# EAGLE design motherBoard (EAGLE 9.3.1)

## Sheet 1 of 2
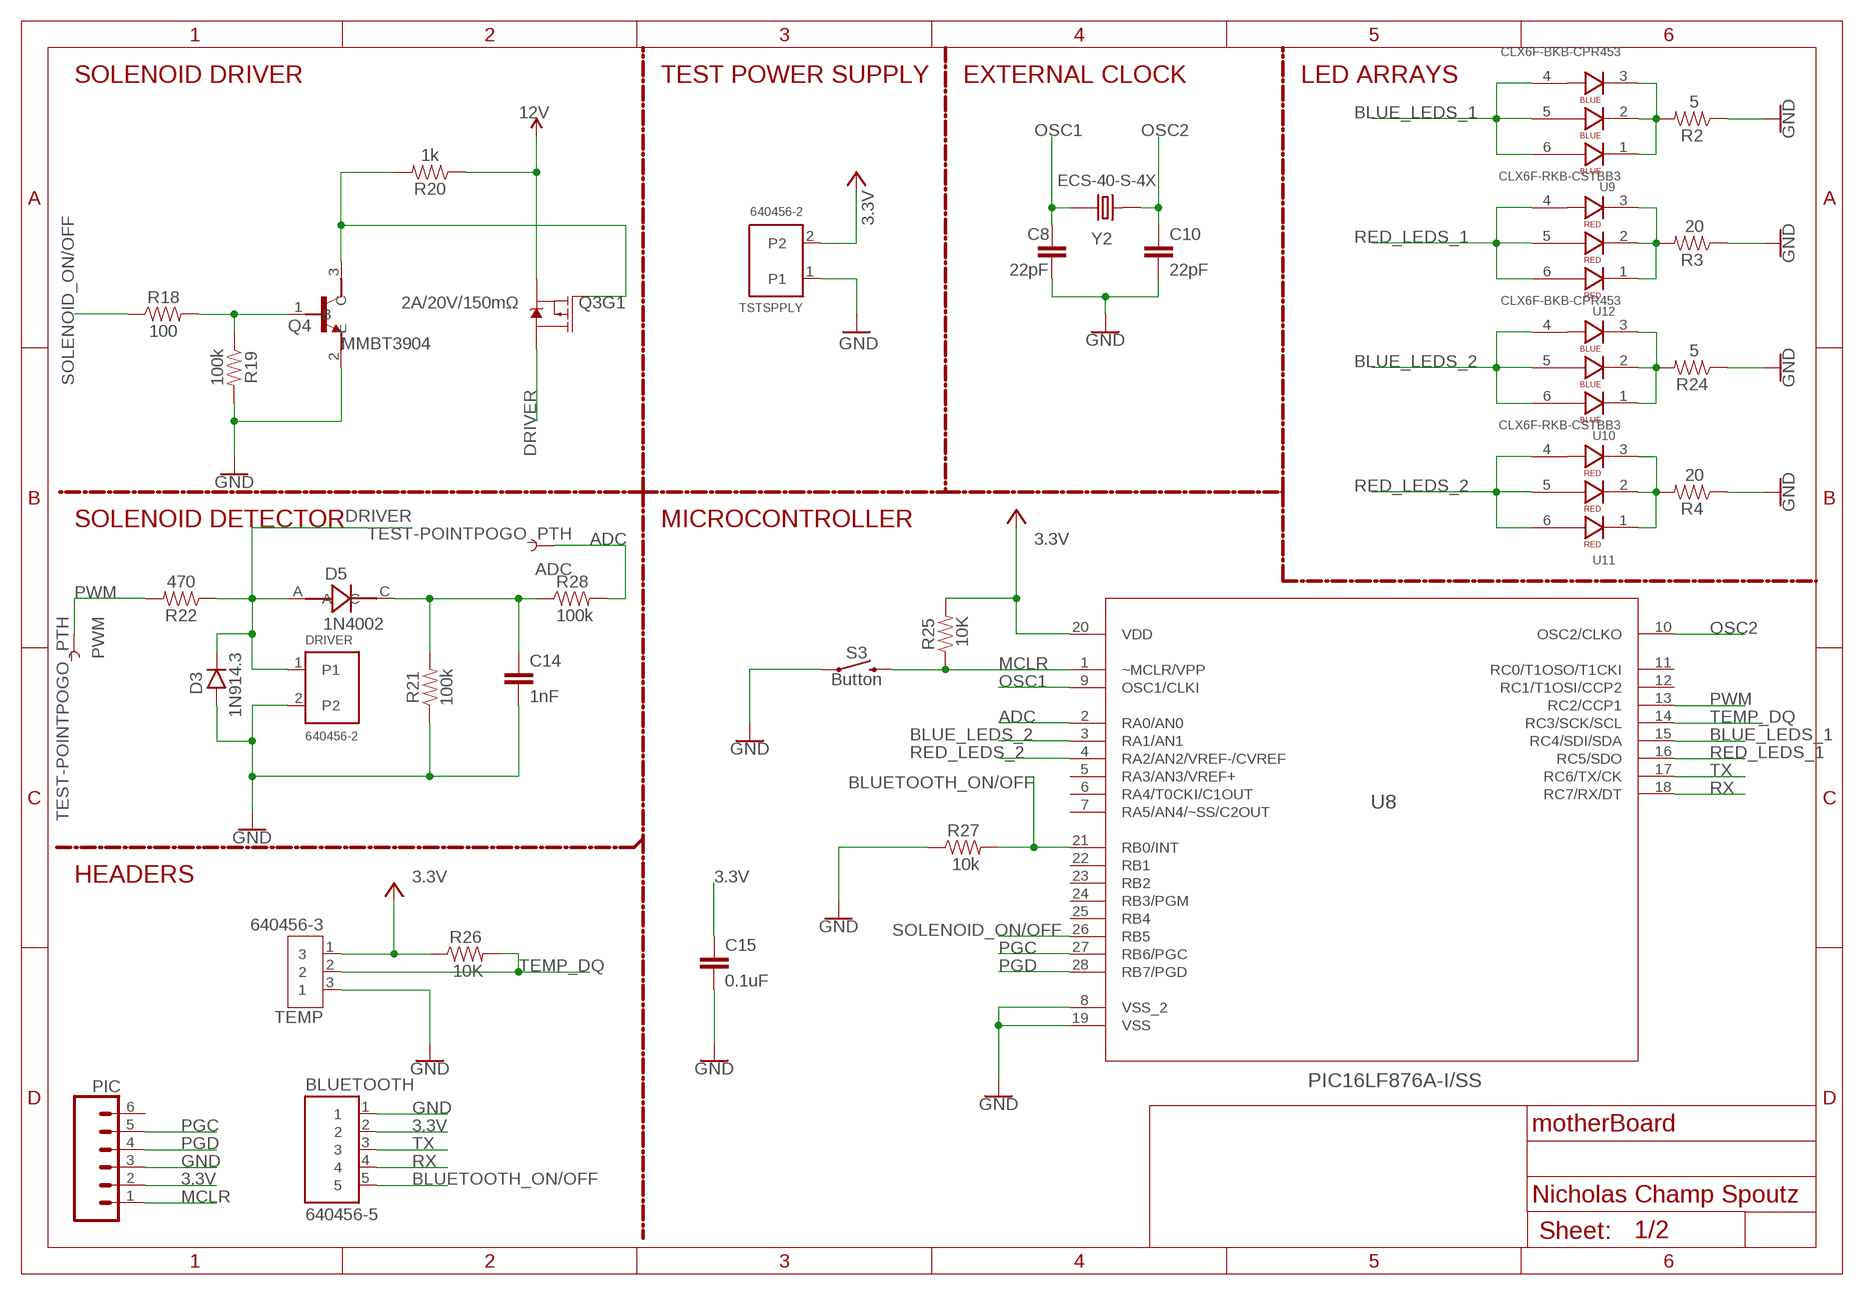
[diagram p0: schematic, sheet 1]

### Parts
ADC  TEST-POINTPOGO_PTH  [1X01_NO_SILK]
BLUETOOTH  640456-5  [TE_640456-5]
C8  22pF  22PF-0603-50V-5%  [0603]
C10  22pF  22PF-0603-50V-5%  [0603]
C14  1nF  1.0NF/1000PF-0603-50V-10%  [0603]
C15  0.1uF  0.1UF-0603-25V-5%  [0603]
D3  1N914.3  [DO35-3]
D5  1N4002  [DIOAD520W79L463D238]
DRIVER  640456-2  [TE_640456-2]
PIC  CONN_06SILK_FEMALE_PTH  [1X06]
PWM  TEST-POINTPOGO_PTH  [1X01_NO_SILK]
Q3  2A/20V/150mΩ  MOSFET_PCH_DUAL-DMP2240UDM  [SOT26]
Q4  MMBT3904  [SOT95P240X120-3N]
R2  5  RESISTOR0603  [0603]
R3  20  RESISTOR0603  [0603]
R4  20  RESISTOR0603  [0603]
R18  100  100OHM-0603-1/4W-5%  [0603]
R19  100k  100KOHM-0603-1/10W-1%  [0603]
R20  1k  1KOHM-0603-1/10W-1%  [0603]
R21  100k  100KOHM-0603-1/10W-1%  [0603]
R22  470  470OHM-0603-1/10W-1%  [0603]
R24  5  RESISTOR0603  [0603]
R25  10K  RESISTOR0603  [0603]
R26  10K  RESISTOR0603  [0603]
R27  10k  RESISTOR0603  [0603]
R28  100k  RESISTOR0603  [0603]
S3  Button  MOMENTARY-SWITCH-SPST-SMD-5.2MM  [TACTILE_SWITCH_SMD_5.2MM]
TEMP  640456-3  [CONN_640456-3]
TSTSPPLY  640456-2  [TE_640456-2]
U8  PIC16LF876A-I/SS  [SOP254P785X200-28N]
U9  CLX6F-BKB-CPR453  [SOJ100P350X290-6N]
U10  CLX6F-BKB-CPR453  [SOJ100P350X290-6N]
U11  CLX6F-RKB-CSTBB3  [SOJ100P350X290-6N]
U12  CLX6F-RKB-CSTBB3  [SOJ100P350X290-6N]
Y2  ECS-40-S-4X  [XTAL_ECS-40-S-4X]

### Nets
3.3V: BLUETOOTH.2 C15.1 PIC.2 R25.2 R26.1 TEMP.1 TSTSPPLY.2 U8.20(VDD) ; also sheet 2
12V: Q3.S1(S) R20.1 ; also sheet 2
ADC: ADC.1 R28.2 U8.2(RA0/AN0)
BLUE_LEDS_1: U8.15(RC4/SDI/SDA) U9.4 U9.5 U9.6
BLUE_LEDS_2: U8.3(RA1/AN1) U10.4 U10.5 U10.6
BLUETOOTH_ON/OFF: BLUETOOTH.5 R27.2 U8.21(RB0/INT)
DRIVER: D3.C D5.A DRIVER.1 Q3.D1(D) R22.1
GND: BLUETOOTH.1 C8.2 C10.2 C14.2 C15.2 D3.A DRIVER.2 PIC.3 Q4.2(E) R2.1 R3.1 R4.1 R19.2 R21.1 R24.1 R27.1 S3.1 TEMP.3 TSTSPPLY.1 U8.8(VSS_2) U8.19(VSS) ; also sheet 2
MCLR: PIC.1 R25.1 S3.3 U8.1(~MCLR/VPP)
N$3: R2.2 U9.1 U9.2 U9.3
N$4: C14.1 D5.C R21.2 R28.1
N$5: R3.2 U12.1 U12.2 U12.3
N$21: R24.2 U10.1 U10.2 U10.3
N$22: Q4.1(B) R18.2 R19.1
N$23: Q3.G1(G) Q4.3(C) R20.2
N$25: R4.2 U11.1 U11.2 U11.3
OSC1: C8.1 U8.9(OSC1/CLKI) Y2.1
OSC2: C10.1 U8.10(OSC2/CLKO) Y2.2
PGC: PIC.5 U8.27(RB6/PGC)
PGD: PIC.4 U8.28(RB7/PGD)
PWM: PWM.1 R22.2 U8.13(RC2/CCP1)
RED_LEDS_1: U8.16(RC5/SDO) U12.4 U12.5 U12.6
RED_LEDS_2: U8.4(RA2/AN2/VREF-/CVREF) U11.4 U11.5 U11.6
RX: BLUETOOTH.4 U8.18(RC7/RX/DT)
SOLENOID_ON/OFF: R18.1 U8.26(RB5)
TEMP_DQ: R26.2 TEMP.2 U8.14(RC3/SCK/SCL)
TX: BLUETOOTH.3 U8.17(RC6/TX/CK)
Unconnected: PIC.6 Q3.D2(D) Q3.G2(G) Q3.S2(S) U8.5(RA3/AN3/VREF+) U8.6(RA4/T0CKI/C1OUT) U8.7(RA5/AN4/~SS/C2OUT) U8.11(RC0/T1OSO/T1CKI) U8.12(RC1/T1OSI/CCP2) U8.22(RB1) U8.23(RB2) U8.24(RB3/PGM) U8.25(RB4)

### Notes on the sheet
- SOLENOID DRIVER | TEST POWER SUPPLY | EXTERNAL CLOCK | LED ARRAYS
- SOLENOID DETECTOR | MICROCONTROLLER
- HEADERS
- Nicholas Champ Spoutz

## Sheet 2 of 2
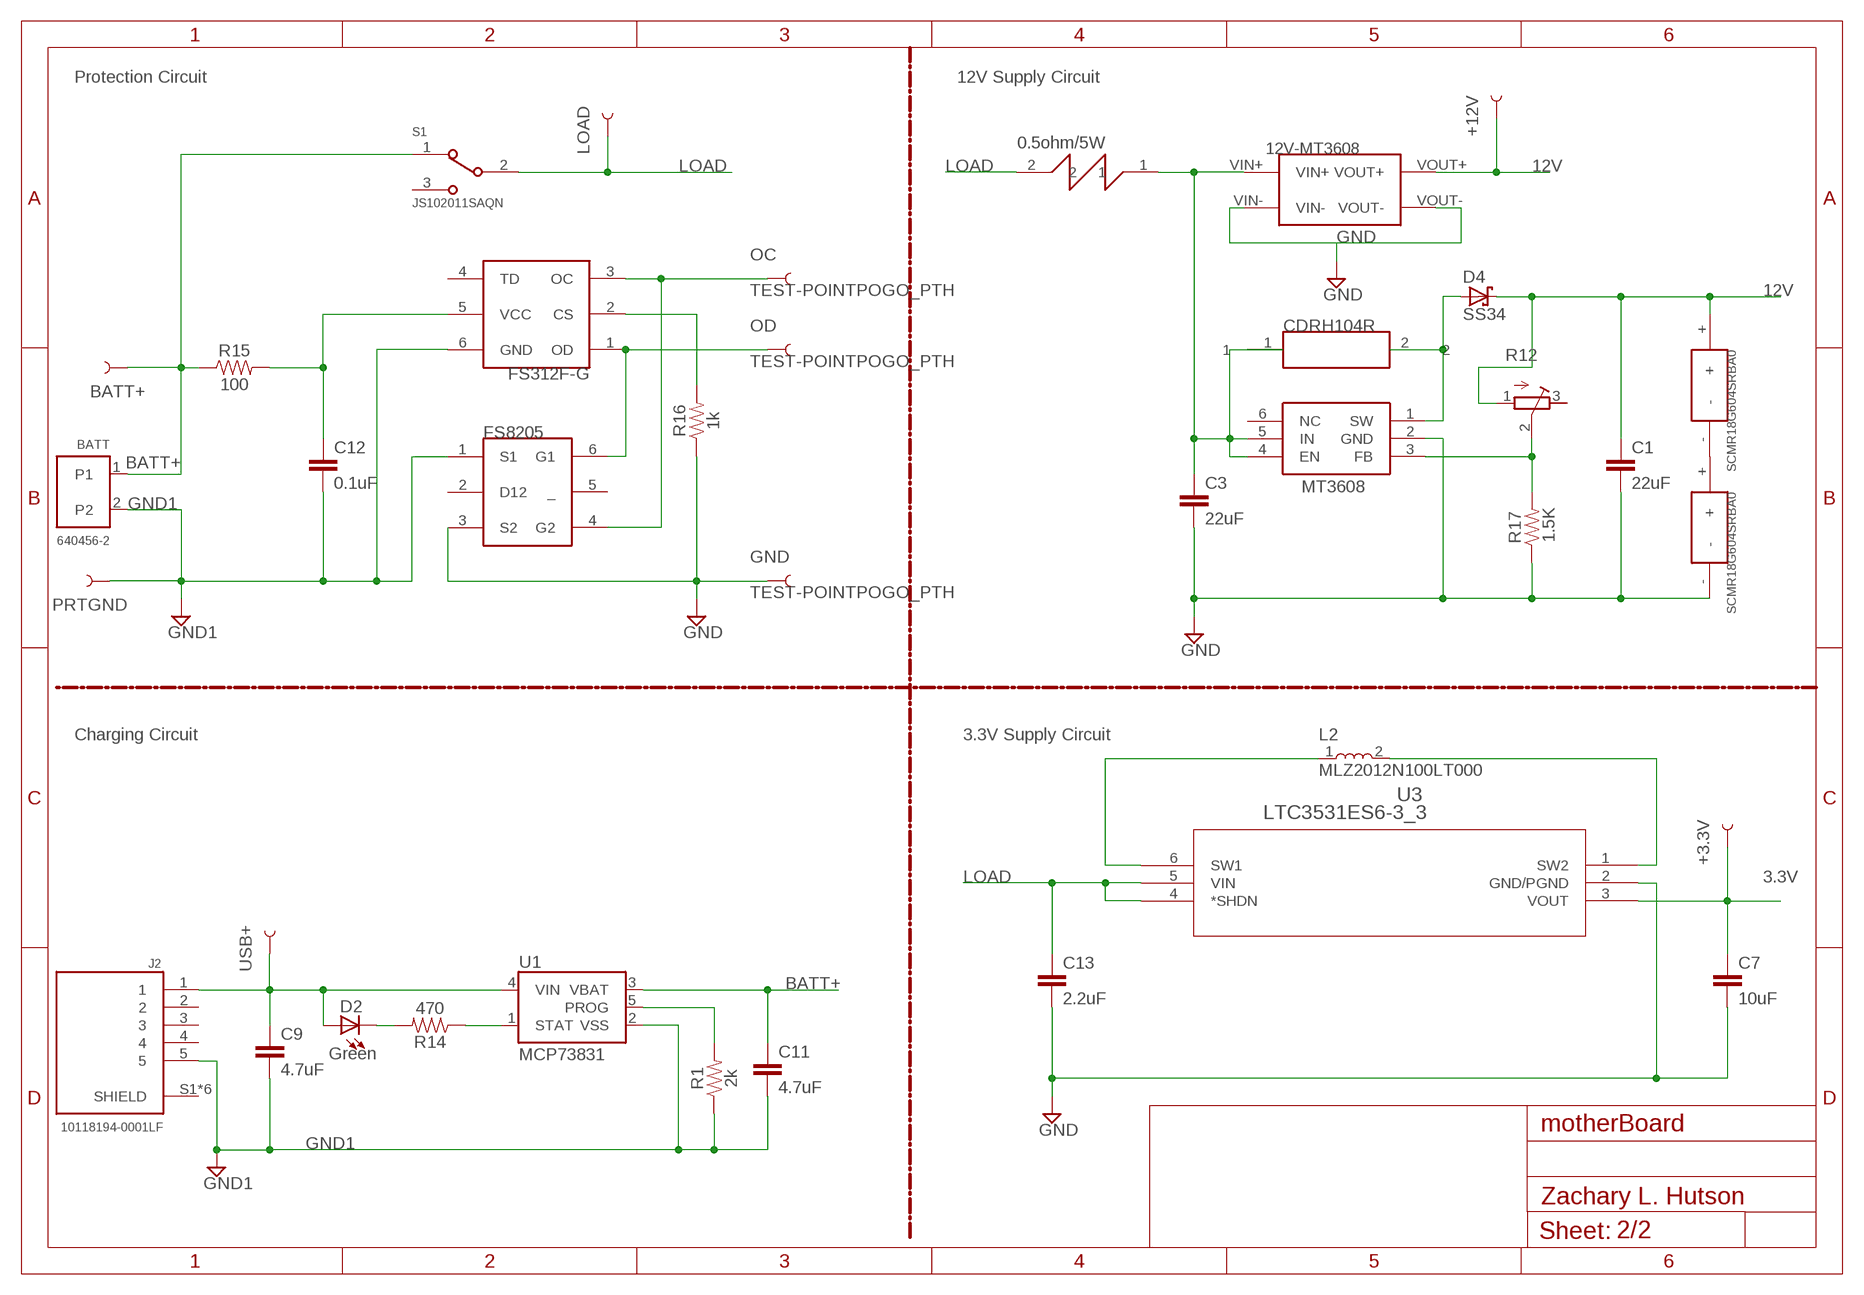
[diagram p1: schematic, sheet 2]

### Parts
+3.3V  TEST-POINTPOGO_PTH  [1X01_NO_SILK]
+12V  TEST-POINTPOGO_PTH  [1X01_NO_SILK]
BATT  640456-2  [TE_640456-2]
BATT+  TEST-POINTPOGO_PTH  [1X01_NO_SILK]
C1  22uF  22UF-0805-6.3V-20%  [0805]
C3  22uF  10UF-0603-6.3V-20%  [0603]
C7  10uF  10UF-0603-6.3V-20%  [0603]
C9  4.7uF  10UF-0603-6.3V-20%  [0603]
C11  4.7uF  0.1UF-0603-25V-(+80/-20%)  [0603]
C12  0.1uF  0.1UF-0603-25V-(+80/-20%)  [0603]
C13  2.2uF  2.2UF-0603-10V-20%  [0603]
C16  SCMR18G604SRBA0  [SUPERCAP]
C17  SCMR18G604SRBA0  [SUPERCAP]
D2  Green  LED0603  [LED-0603]
D4  SS34  [SMB]
GND  TEST-POINTPOGO_PTH  [1X01_NO_SILK]
J2  10118194-0001LF  [AMPHENOL_10118194-0001LF]
L1  CDRH104R  [220-INDUCTOR]
L2  MLZ2012N100LT000  [INDC2012X125]
LOAD  TEST-POINTPOGO_PTH  [1X01_NO_SILK]
OC  TEST-POINTPOGO_PTH  [1X01_NO_SILK]
OD  TEST-POINTPOGO_PTH  [1X01_NO_SILK]
PRTGND  TEST-POINTPOGO_PTH  [1X01_NO_SILK]
R1  2k  RESISTOR0603  [0603]
R12  R-TRIMM3296P  [RTRIM3296P]
R14  470  RESISTOR0603  [0603]
R15  100  RESISTOR0603  [0603]
R16  1k  RESISTOR0603  [0603]
R17  1.5K  RESISTOR0603  [0603]
R30  WNER50FET  [RESISTOR]
S1  JS102011SAQN  [SW_JS102011SAQN]
U1  MCP73831  [SOT23-5]
U2  MT3608  [SOT95P280X145-6N]
U3  LTC3531ES6-3_3  [TSOT-23_S6]
U$1  12V-BOARD  [PERF_BOARD]
U$3  FS312F-G  [SOT-23-6]
U$4  FS8205  [SOT-23-6]
USB+  TEST-POINTPOGO_PTH  [1X01_NO_SILK]

### Nets
3.3V: +3.3V.1 C7.1 U3.3(VOUT) ; also sheet 1
12V: +12V.1 C1.1 C16.+ D4.C R12.1(E) U$1.VOUT+ ; also sheet 1
BATT+: BATT+.1 BATT.1 C11.1 R15.1 S1.1 U1.3(VBAT)
GND: C1.2 C3.2 C7.2 C13.2 C17.- GND.1 R16.1 R17.1 U2.2(GND) U3.2(GND/PGND) U$1.VIN- U$1.VOUT- U$4.3(S2) ; also sheet 1
GND1: BATT.2 C9.2 C11.2 C12.2 J2.5 PRTGND.1 R1.1 U1.2(VSS) U$3.6(GND) U$4.1(S1)
LOAD: C13.1 LOAD.1 R30.2 S1.2 U3.4(*SHDN) U3.5(VIN)
N$1: D2.C R14.2
N$2: C3.1 L1.1 R30.1 U2.4(EN) U2.5(IN) U$1.VIN+
N$7: R14.1 U1.1(STAT)
N$9: R1.2 U1.5(PROG)
N$10: R16.2 U$3.2(CS)
N$11: C9.1 D2.A J2.1 U1.4(VIN) USB+.1
N$12: D4.A L1.2 U2.1(SW)
N$13: R12.2(S) R17.2 U2.3(FB)
N$14: L2.1 U3.6(SW1)
N$15: L2.2 U3.1(SW2)
N$17: OD.1 U$3.1(OD) U$4.6(G1)
N$18: OC.1 U$3.3(OC) U$4.4(G2)
N$19: C16.- C17.+
N$20: C12.1 R15.2 U$3.5(VCC)
Unconnected: J2.2 J2.3 J2.4 J2.S1(SHIELD) J2.S2(SHIELD) J2.S3(SHIELD) J2.S4(SHIELD) J2.S5(SHIELD) J2.S6(SHIELD) R12.3(A) S1.3 U2.6(NC) U$3.4(TD) U$4.2(D12) U$4.5(_)

### Notes on the sheet
- Protection Circuit | 12V Supply Circuit
- Charging Circuit | 3.3V Supply Circuit
- Zachary L. Hutson

## Library data of the parts
+3.3V +12V ADC BATT+ GND LOAD OC OD PRTGND PWM USB+ = SparkFun-Connectors:TEST-POINT: SparkFun Test Points Bare copper test points for troubleshooting or In-Circuit-Testing. These are used by our Production team for verifying production board runs using pogo-pins on test beds. SparkFun Products: SparkFun LSM9DS1 Breakout <https://www.sparkfun.com/products/13284> SparkFun PSOC <https://www.sparkfun.com/products/13714> SparkFun Load Cell Amplifier <https://www.sparkfun.com/products/13879>
BATT DRIVER TSTSPPLY = 640456-2:640456-2: CONN HEADER VERT 2POS .100 TIN; COMMENT: 640456-2; DESCRIPTION: 02P MTA100 HDR ASSY F/L SQ STR; DIGI-KEY_PART_NUMBER: A1921-ND; DIGI-KEY_PURCHASE_URL: https://www.digikey.com/product-detail/en/te-connectivity-amp-connectors/640456-2/A1921-ND/109003?utm_source=snapeda&utm_medium=aggregator&utm_campaign=symbol; EU_ROHS_COMPLIANCE: Compliant; MF: TE Connectivity; MP: 640456-2; PACKAGE: None; TE_PURCHASE_URL: https://www.te.com/usa-en/product-640456-2.html?te_bu=Cor&te_type=disp&te_campaign=seda_glo_cor-seda-global-disp-prtnr-fy19-seda-model-bom-cta_sma-317_1&elqCampaignId=32493
BLUETOOTH = 640456-5:640456-5: CONN HEADER VERT 5POS .100 TIN; CENTERLINE_PITCH: 2.54 mm[.1 in]; COMMENT: 640456-5; DESCRIPTION: 05P MTA100 HDR ASSY F/L SQ STR; DIGI-KEY_PART_NUMBER: A19471-ND; DIGI-KEY_PURCHASE_URL: https://www.digikey.com/product-detail/en/te-connectivity-amp-connectors/640456-5/A19471-ND/259011?utm_source=snapeda&utm_medium=aggregator&utm_campaign=symbol; EU_ROHS_COMPLIANCE: Compliant; MF: TE Connectivity; MP: 640456-5; NUMBER_OF_POSITIONS: 5; PACKAGE: None; PRODUCT_TYPE: Connector; TE_PURCHASE_URL: https://www.te.com/usa-en/product-640456-5.html?te_bu=Cor&te_type=disp&te_campaign=seda_glo_cor-seda-global-disp-prtnr-fy19-seda-model-bom-cta_sma-317_1&elqCampaignId=32493
C1 = SparkFun-Capacitors:22UF: 22µF ceramic capacitors A capacitor is a passive two-terminal electrical component used to store electrical energy temporarily in an electric field.; PROD_ID: CAP-08402
C3 C9 = SparkFun-Capacitors:10UF: 10.0µF ceramic capacitors A capacitor is a passive two-terminal electrical component used to store electrical energy temporarily in an electric field.; PROD_ID: CAP-11015; VALUE: 10uF
C7 = SparkFun-Capacitors:10UF: 10.0µF ceramic capacitors A capacitor is a passive two-terminal electrical component used to store electrical energy temporarily in an electric field.; PROD_ID: CAP-11015
C8 C10 = SparkFun-Capacitors:22PF: 22pF ceramic capacitors A capacitor is a passive two-terminal electrical component used to store electrical energy temporarily in an electric field.; PROD_ID: CAP-07876
C11 = SparkFun-Capacitors:0.1UF: 0.1µF ceramic capacitors A capacitor is a passive two-terminal electrical component used to store electrical energy temporarily in an electric field.; PROD_ID: CAP-00810; VALUE: 0.1uF
C12 = SparkFun-Capacitors:0.1UF: 0.1µF ceramic capacitors A capacitor is a passive two-terminal electrical component used to store electrical energy temporarily in an electric field.; PROD_ID: CAP-00810
C13 = SparkFun-Capacitors:2.2UF: 2.2µF ceramic capacitors A capacitor is a passive two-terminal electrical component used to store electrical energy temporarily in an electric field.; PROD_ID: CAP-07888
C14 = SparkFun-Capacitors:1.0NF/1000PF: 1nF/1,000pF ceramic capacitors A capacitor is a passive two-terminal electrical component used to store electrical energy temporarily in an electric field.; PROD_ID: CAP-07886
C15 = SparkFun-Capacitors:0.1UF: 0.1µF ceramic capacitors A capacitor is a passive two-terminal electrical component used to store electrical energy temporarily in an electric field.; PROD_ID: CAP-08604
C16 C17 = SCMRCapacitor:SCMR18G604SRBA0: SCMR18G604SRBA0: 0.6F/7.5V/1.77A
D2 = SparkFun:LED: LEDs Standard schematic elements and footprints for 5mm, 3mm, 1206, and 0603 sized LEDs. 5mm - Spark Fun Electronics SKU : COM-00529 (and others)
D3 = 1N914:1N914: Fast Switching Diode DO-35 glass case a.k.a. 1N4148; AVAILABILITY: Unavailable; DESCRIPTION: 1N914 Series 500 mW 100 V Max Reverse Voltage Small Signal Diode - DO-35; MF: Microsemi Corporation; MP: 1N914; PACKAGE: DO-35 ON Semiconductor; PRICE: None
D4 = SS34:SS34: 3A 40V Schottky diode; AVAILABILITY: Unavailable; DESCRIPTION: SS Series 500 mV 3 A 40 V Max Reverse Voltage Schottky Rectifier - DO-214AB; MF: ON Semiconductor; MP: SS34; PACKAGE: DO-214 ON Semiconductor; PRICE: None
D5 = 1N4002:1N4002: 1N400 Series 1.1 V 1 A 100 V Max Reverse Voltage Standard Rectifier - DO-41; AVAILABILITY: Unavailable; DESCRIPTION: Diode Gen Purp 100v 1a Do41; MF: ON Semiconductor; MP: 1N4002; PACKAGE: DO-204 MCC; PRICE: None
J2 = 10118194-0001LF:10118194-0001LF: Micro Usb, 2.0 Type b, Rcpt, Smt; AVAILABILITY: Unavailable; DESCRIPTION: Micro Usb, 2.0 Type b, Rcpt, Smt; MF: Amphenol ICC; MP: 10118194-0001LF; PACKAGE: None; PRICE: None
L1 = CDRH104R:CDRH104R: CDRH104C: Ferrite drum core construction. • Magnetically shielded. • L×W×H:10.5×10.3×4.0mm Max. • Product weight: 1.5g(Ref.) • Moisture Sensitivity Level: 1 • RoHS compliance. • Halogen Free available.
L2 = MLZ2012N100LT000:MLZ2012N100LT000: Surface Mount High Frequency Inductor, MLZ Series, 10 H, 20%, 0805 [2012 Metric], 0.3 ohm; DESCRIPTION: Surface Mount High Frequency Inductor, MLZ Series, 10 H, 20%, 0805 [2012 Metric], 0.3 ohm; DIGI-KEY_PART_NUMBER: 445-6762-1-ND; DIGI-KEY_PURCHASE_URL: https://www.digikey.com/product-detail/en/tdk-corporation/MLZ2012N100LT000/445-6762-1-ND/2523583?utm_source=snapeda&utm_medium=aggregator&utm_campaign=symbol; MF: TDK; MP: MLZ2012N100LT000; PACKAGE: 0805 TDK
PIC = SparkFun-Connectors:CONN_06: Multi connection point. Often used as Generic Header-pin footprint for 0.1 inch spaced/style header connections On any of the 0.1 inch spaced packages, you can populate with these: Break Away Headers - Straight <https://www.sparkfun.com/products/116> (PRT-00116) Break Away Male Headers - Right Angle <https://www.sparkfun.com/products/553> (PRT-00553) Female Headers <https://www.sparkfun.com/products/115> (PRT-00115) Break Away Headers - Machine Pin <https://www.sparkfun.com/products/117> (PRT-00117) Break Away Female Headers - Swiss Machine Pin <https://www.sparkfun.com/products/743> (PRT-00743) Arduino Stackable Header - 6 Pin <https://www.sparkfun.com/products/9280> (PRT-09280) For SCREWTERMINALS and SPRING TERMINALS visit here: Screw Terimnals on SparkFun.com <https://www.sparkfun.com/search/results?term=Screw+Terminals> (5mm/3.5mm/2.54mm spacing) This device is also useful as a general connection point to wire up your design to another part of your project. Our various solder wires solder well into these plated through hole pads. Hook-Up Wire - Assortment (Stranded, 22 AWG) <https://www.sparkfun.com/products/11375> (PRT-11375) Hook-Up Wire - Assortment (Solid Core, 22 AWG) <https://www.sparkfun.com/products/11367> (PRT-11367) View the entire wire category on our website here <https://www.sparkfun.com/categories/141>; PROD_ID: CONN-08437
Q3 = SparkFun-DiscreteSemi:MOSFET_PCH_DUAL: Dual P-Channel -20VDS MOSFET Link to datasheet <http://www.diodes.com/_files/datasheets/ds31197.pdf> SparkFun Products: SparkFun FreeSoC2 Development Board <https://www.sparkfun.com/products/13229>; PROD_ID: TRANS-12444
Q4 = MMBT3904:MMBT3904: MMBT3904 Series 40 V CE Breakdown 0.2 A NPN General Purpose Amplifier - SOT-23; DESCRIPTION: SOT-23, 60V, 0.2A, NPN Bipolar Transistor; DIGI-KEY_PART_NUMBER: 497-2478-1-ND; DIGI-KEY_PURCHASE_URL: https://www.digikey.com/product-detail/en/stmicroelectronics/MMBT3904/497-2478-1-ND/603860?utm_source=snapeda&utm_medium=aggregator&utm_campaign=symbol; MF: STMicroelectronics; MP: MMBT3904; PACKAGE: SOT-23-3 Taiwan Semiconductor
R1-R4 R14-R17 R24-R28 = SparkFun-Resistors:RESISTOR: Generic Resistor Package
R12 = rcl:R-TRIMM: Trimm resistor
R18 = SparkFun-Resistors:100OHM: 100Ω resistor A resistor is a passive two-terminal electrical component that implements electrical resistance as a circuit element. Resistors act to reduce current flow, and, at the same time, act to lower voltage levels within circuits. - Wikipedia; PROD_ID: RES-12438
R19 R21 = SparkFun-Resistors:100KOHM: 100kΩ resistor A resistor is a passive two-terminal electrical component that implements electrical resistance as a circuit element. Resistors act to reduce current flow, and, at the same time, act to lower voltage levels within circuits. - Wikipedia; PROD_ID: RES-07828
R20 = SparkFun-Resistors:1KOHM: 1kΩ resistor A resistor is a passive two-terminal electrical component that implements electrical resistance as a circuit element. Resistors act to reduce current flow, and, at the same time, act to lower voltage levels within circuits. - Wikipedia; PROD_ID: RES-07856
R22 = SparkFun-Resistors:470OHM: 470Ω resistor A resistor is a passive two-terminal electrical component that implements electrical resistance as a circuit element. Resistors act to reduce current flow, and, at the same time, act to lower voltage levels within circuits. - Wikipedia; PROD_ID: RES-07869
R30 = WNER50FET:WNER50FET: WNER50FET: 0.5ohm, 5W Resistor for 12V DC-DC Converter
S1 = JS102011SAQN:JS102011SAQN: JS10 Series SPDT On-On 6 V 0.3 A Gull Wing SMT Slide Switch http://www.snapeda.com/parts/JS102011SAQN/C%26K%20Components/view-part/; DESCRIPTION: JS10 Series SPDT On-On 6 V 0.3 A Gull Wing SMT Slide Switch; DIGI-KEY_PART_NUMBER: 401-1999-1-ND; DIGI-KEY_PURCHASE_URL: https://www.digikey.com/product-detail/en/c-k/JS102011SAQN/401-1999-1-ND/1640114?utm_source=snapeda&utm_medium=aggregator&utm_campaign=symbol; MF: C&K; MP: JS102011SAQN; PACKAGE: None
S3 = SparkFun-Switches:MOMENTARY-SWITCH-SPST: Momentary Switch (Pushbutton) - SPST Normally-open (NO) SPST momentary switches (buttons, pushbuttons). Variants PTH-12MM - 12mm square, through-hole Momentary Pushbutton Switch - 12mm Square <https://www.sparkfun.com/products/9190> (COM-09190) PTH-6.0MM, PTH-6.0MM-KIT - 6.0mm square, through-hole Mini Pushbutton Switch <https://www.sparkfun.com/products/97> (COM-00097) KIT package intended for soldering kit's - only one side of pads' copper is exposed. PTH-RIGHT-ANGLE-KIT - Right-angle, through-hole Right Angle Tactile Button <https://www.sparkfun.com/products/10791> - Used on SparkFun BigTime Watch Kit <https://www.sparkfun.com/products/11734> SMD-12MM - 12mm square, surface-mount Tactile Button - SMD (12mm) <https://www.sparkfun.com/products/12993> (COM-12993) Used on SparkFun PicoBoard <https://www.sparkfun.com/products/11888> SMD-4.5MM - 4.5mm Square Trackball Switch Used on SparkFun Blackberry Trackballer Breakout <https://www.sparkfun.com/products/13169> SMD-4.6MMX2.8MM - 4.60mm x 2.80mm, surface mount Used on SparkFun SAMD21 Mini Breakout <https://www.sparkfun.com/products/13664> SMD-5.2MM, SMD-5.2-REDUNDANT - 5.2mm square, surface-mount Mini Pushbutton Switch - SMD <https://www.sparkfun.com/products/8720> (COM-08720) Used on Arduino Pro Mini <https://www.sparkfun.com/products/11114> REDUNDANT package connects both switch circuits together SMD-6.0X3.5MM - 6.0 x 3.5mm, surface mount Momentary Reset Switch SMD <https://www.sparkfun.com/products/8229> (COM-08229) SMD-6.2MM-TALL - 6.2mm square, surface mount Tactile Button - SMD (6mm) <https://www.sparkfun.com/products/12992> Used on SparkFun Digital Sandbox <https://www.sparkfun.com/products/12651> SMD-RIGHT-ANGLE - Right-angle, surface mount Used on SparkFun Block for Intel® Edison - Arduino <https://www.sparkfun.com/products/13036>; PROD_ID: SWCH-08247; SF_SKU: COM-08720
TEMP = 640456-3:640456-3: Header, Friction Lock; MTA-100; 3; 250 VAC; Polyester; Tin; Copper Alloy; Tin; COMMENT: 640456-3; DESCRIPTION: 03P MTA100 HDR ASSY F/L SQ STR; DIGI-KEY_PART_NUMBER: A19470-ND; DIGI-KEY_PURCHASE_URL: https://www.digikey.com/product-detail/en/te-connectivity-amp-connectors/640456-3/A19470-ND/259010?utm_source=snapeda&utm_medium=aggregator&utm_campaign=symbol; EU_ROHS_COMPLIANCE: Compliant; MF: TE Connectivity; MP: 640456-3; PACKAGE: None; TE_PURCHASE_URL: https://www.te.com/usa-en/product-640456-3.html?te_bu=Cor&te_type=disp&te_campaign=seda_glo_cor-seda-global-disp-prtnr-fy19-seda-model-bom-cta_sma-317_1&elqCampaignId=32493
U1 = SparkFun-IC-Power:MCP73831: MCP73831T Li-Ion, Li-Pol Controller Miniature single cell, fully integrated Li-Ion, Li-polymer charge management controller Datasheet <http://ww1.microchip.com/downloads/en/DeviceDoc/20001984g.pdf> SparkFun Products: SparkFun ESP32 Thing <https://www.sparkfun.com/products/13907> SparkFun 9DoF Razor IMU M0 <https://www.sparkfun.com/products/14001>; PROD_ID: IC-09995
U2 = MT3608:MT3608: High Efficiency 1.2MHz 2A Step Up Converter Source: Datasheet <https://www.olimex.com/Products/Breadboarding/BB-PWR-3608/resources/MT3608.pdf>; ARROW_PART_NUMBER: MT3608; DESCRIPTION: High Efficiency 1.2MHz 2A Step Up Converter; HEIGHT: 1.45mm; MANUFACTURER_NAME: Aerosemi; MANUFACTURER_PART_NUMBER: MT3608
U3 = LTC3531ES6-3_3:LTC3531ES6-3_3; AVAILABILITY: Unavailable; DESCRIPTION: LTC3531 - 200mA Buck-Boost Synchronous DC/DC Converters; MF: Linear Technology; MP: LTC3531ES6-3.3; PACKAGE: None; PRICE: None
U8 = PIC16LF876A-I_SS:PIC16LF876A-I/SS: Microcontrollers; AVAILABILITY: Unavailable; DESCRIPTION: PIC16 Series 368 B RAM 14 kB Flash 8-Bit Enhanced Microcontroller - SSOP-28; MF: Microchip; MP: PIC16LF876A-I/SS; PACKAGE: SSOP-28 Microchip; PRICE: None
U9 U10 = CLX6F-LED:CLX6F-BKB-CPR453
U11 U12 = CLX6F-LED:CLX6F-RKB-CSTBB3
U$1 = 12V-Board:12V-BOARD: This is the perf board from Anmbest MT3608 SMD Board
U$3 = FS312F-G:FS312F-G
U$4 = FS8205:FS8205
Y2 = ECS-40-S-4X:ECS-40-S-4X: CRYSTAL T/H; DESCRIPTION: Crystal 4MHz Series 2-Pin HC-49/U; DIGI-KEY_PART_NUMBER: X1044-ND; DIGI-KEY_PURCHASE_URL: https://www.digikey.com/product-detail/en/ecs-inc/ECS-40-S-4X/X1044-ND/827536?utm_source=snapeda&utm_medium=aggregator&utm_campaign=symbol; MF: ECS Inc.; MP: ECS-40-S-4X; PACKAGE: HC49/US ECS International

## Board
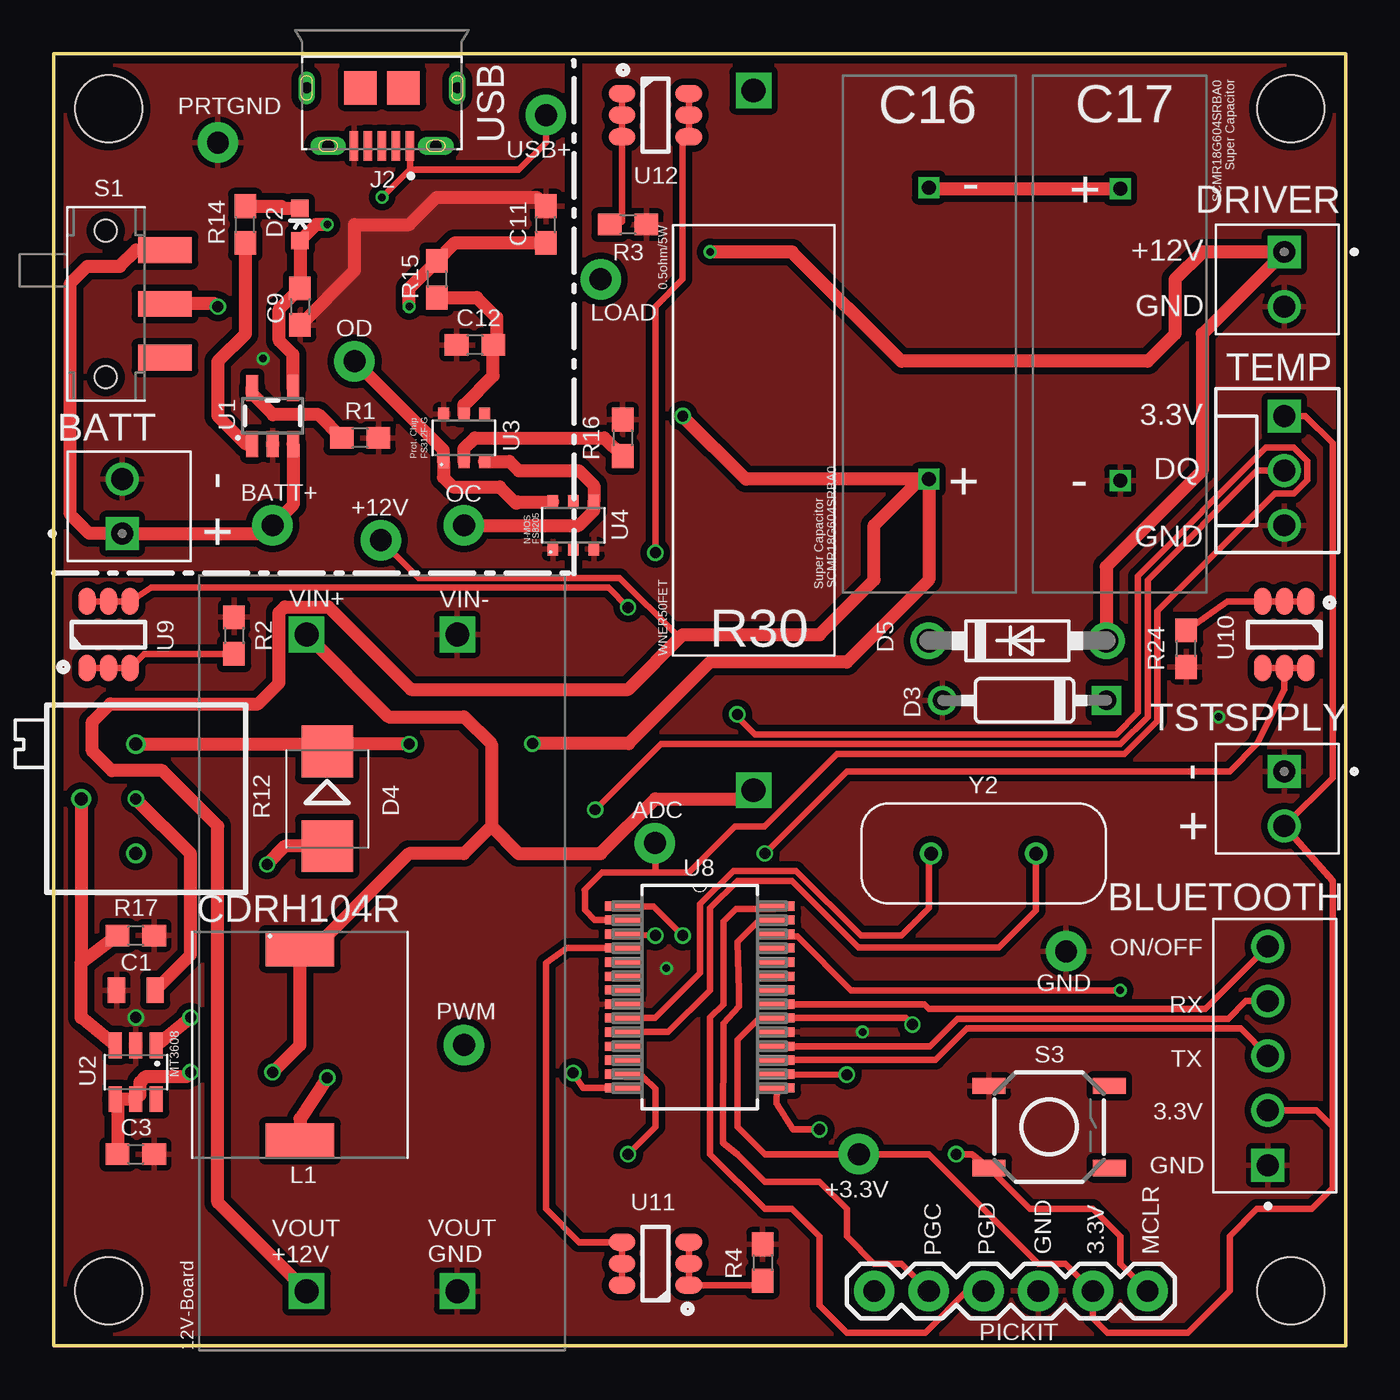
[diagram p2: board, top side]
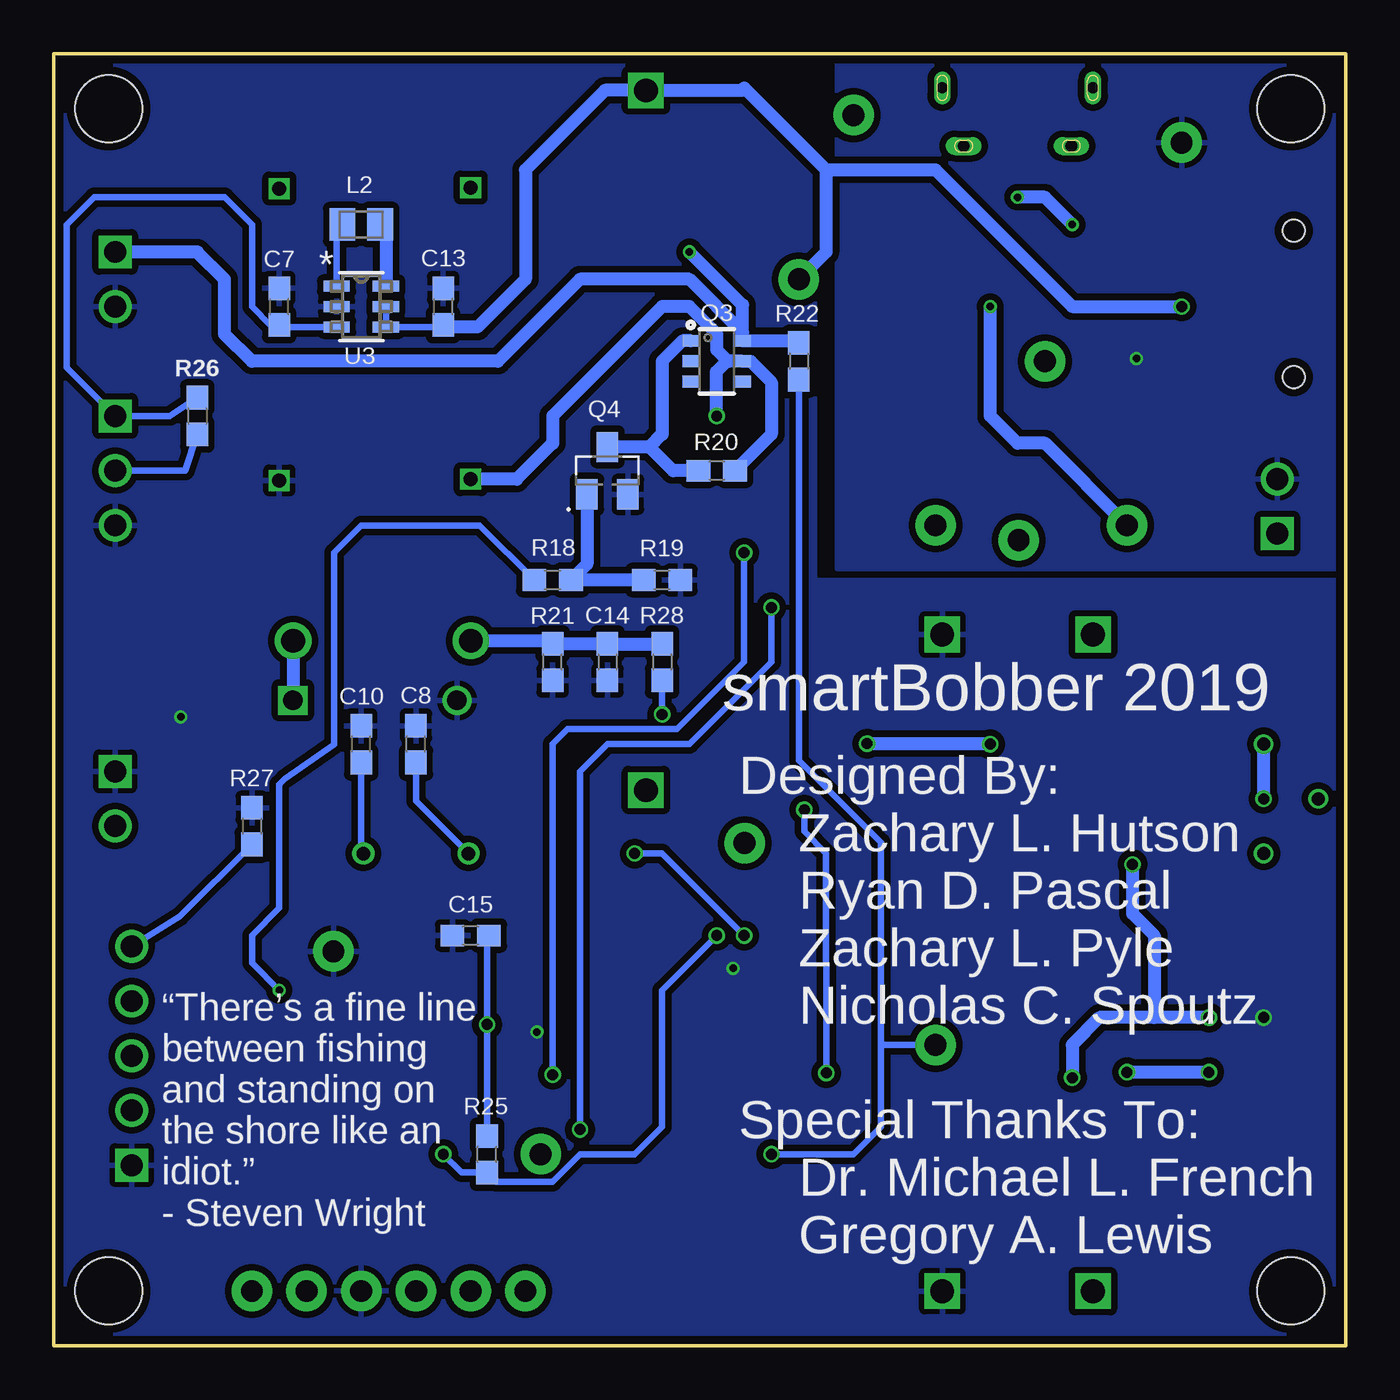
[diagram p3: board, bottom side, seen from below]

Size 60 x 60 mm. Coordinates in mm from the lower left corner, seen from the top.
Outline: 0,0 60,0 60,60 0,60 0,0
Copper layers (1*16): Top 0.035559375mm / dielectric 1.6mm / Bottom 0.035559375mm
Design rules "oshpark-2layer": minimum track width 6mil, minimum drill 10mil, track to track 6mil, track to pad 6mil, pad to pad 6mil, via to via 6mil, smd to smd 6mil, copper to edge 15mil, drill to drill 6mil, minimum pad ring 5mil, minimum via ring 5mil, stop-mask expansion 2.5mil, vias tented up to drill 0mil, thermal gap 10mil
Holes 3.1 mm at 57.46,57.46 57.46,2.54 2.54,2.54 2.54,57.46

### Footprints (pad centres in the part's own frame; a part is rotated, then mirrored left to right if it is on the bottom)
1X01_NO_SILK = drill 1.016 pad 1.88: 1 0,0
TE_640456-2 = drill 1.02 square: 1 0,0 | drill 1.02: 2 2.54,0
TE_640456-5 = drill 1.02 square: 1 0,0 | drill 1.02: 2 2.54,0; 3 5.08,0; 4 7.62,0; 5 10.16,0
0805 = smd 0.8 x 1.2: 1 -0.9,0; 2 0.9,0
0603 = smd 1.1 x 1: 1 -0.85,0; 2 0.85,0
SUPERCAP = drill 0.65 square: + -6.75,0; - 6.8,0
LED-0603 = smd 0.8 x 0.8: A 0,-0.75; C 0,0.75
DO35-3 = drill 0.9: A 3.81,0 | drill 0.9 square: C -3.81,0
SMB = smd 2.4 x 2.4: A 2.2,0; C -2.2,0
DIOAD520W79L463D238 = drill 1.1 pad 1.7: A 4.445,0; C -3.81,0
AMPHENOL_10118194-0001LF = smd 0.4 x 1.35: 1 -1.3,2.7; 2 -0.65,2.7; 3 0,2.7; 4 0.65,2.7; 5 1.3,2.7 | drill 0.55 pad 0.65 long: S1 -2.5,2.7; S2 2.5,2.7 | drill 0.5 pad 0.775 long: S3 -3.5,0; S6 3.5,0 | smd 1.5 x 1.55: S4 -1,0; S5 1,0
220-INDUCTOR = smd 3.2 x 1.6: 1 0,4.45; 2 0,-4.45
INDC2012X125 = smd 1.2 x 1.5: 1 -0.875,0; 2 0.875,0
1X06 = drill 1.016 pad 1.88: 1 0,0; 2 2.54,0; 3 5.08,0; 4 7.62,0; 5 10.16,0; 6 12.7,0
SOT26 = smd 0.55 x 0.8: D1 -0.95,1.2; D2 0.95,1.2; G1 -0.95,-1.2; G2 0.95,-1.2; S1 0,1.2; S2 0,-1.2
SOT95P240X120-3N = smd 1 x 1.4: 1 -0.95,-1.1; 2 0.95,-1.1; 3 0,1.1
RTRIM3296P = drill 0.61: 1 0,-2.54; 2 2.54,0; 3 0,2.54
RESISTOR = drill 1.1 square: 1 -16.25,0; 2 16.25,0
SW_JS102011SAQN = smd 1.2 x 2.5: 1 -2.5,2.75; 2 0,2.75; 3 2.5,2.75 | hole 1: -3.4,0; 3.4,0
TACTILE_SWITCH_SMD_5.2MM = smd 1.524 x 0.762: 1 -2.794,1.905; 2 2.794,1.905; 3 -2.794,-1.905; 4 2.794,-1.905
CONN_640456-3 = drill 1.016 square: 1 2.54,0 | drill 1.016: 2 0,0; 3 -2.54,0
SOT23-5 = smd 0.55 x 1.2: 1 -0.95,-1.3; 2 0,-1.3; 3 0.95,-1.3; 4 0.95,1.3; 5 -0.95,1.3
SOT95P280X145-6N = smd 1.2 x 0.6: 1 -1.25,0.95; 2 -1.25,0; 3 -1.25,-0.95; 4 1.25,-0.95; 5 1.25,0; 6 1.25,0.95
TSOT-23_S6 = smd 1.219 x 0.508: 1 -1.143,0.95; 2 -1.143,0; 3 -1.143,-0.95; 4 1.143,-0.95; 5 1.143,0; 6 1.143,0.95
SOP254P785X200-28N = smd 1.651 x 0.432: 1 -3.581,4.216; 2 -3.581,3.581; 3 -3.581,2.921; 4 -3.581,2.286; 5 -3.581,1.626; 6 -3.581,0.965; 7 -3.581,0.33; 8 -3.581,-0.33; 9 -3.581,-0.965; 10 -3.581,-1.626; 11 -3.581,-2.286; 12 -3.581,-2.921; 13 -3.581,-3.581; 14 -3.581,-4.216; 15 3.581,-4.216; 16 3.581,-3.581; 17 3.581,-2.921; 18 3.581,-2.286; 19 3.581,-1.626; 20 3.581,-0.965; 21 3.581,-0.33; 22 3.581,0.33; 23 3.581,0.965; 24 3.581,1.626; 25 3.581,2.286; 26 3.581,2.921; 27 3.581,3.581; 28 3.581,4.216
SOJ100P350X290-6N = smd 1.25 x 0.8: 1 -1.55,1; 2 -1.55,0; 3 -1.55,-1; 4 1.55,-1; 5 1.55,0; 6 1.55,1
PERF_BOARD = drill 1.1 square: VIN+ 15.25,3.5; VIN- 15.25,-3.5; VOUT+ -15.25,3.5; VOUT- -15.25,-3.5
SOT-23-6 = smd 0.6 x 0.5: 1 -1.1,0.95; 2 -1.1,0; 3 -1.1,-0.95; 4 1.1,-0.95; 5 1.1,0; 6 1.1,0.95
XTAL_ECS-40-S-4X = drill 0.63 pad 1.03: 1 -2.44,0; 2 2.44,0

### Placement (x,y rotation side)
+3.3V  37.39,8.89 0 top
+12V  15.19,37.41 0 top
ADC  27.91,23.34 0 top
BATT  3.17,37.72 90 top
BATT+  10.16,38.1 0 top
BLUETOOTH  56.39,8.38 90 top
C1  3.81,16.51 180 top
C3  3.81,8.89 0 top
C7  49.53,48.26 90 bottom
C8  43.18,27.94 90 bottom
C9  11.43,48.26 270 top
C10  45.72,27.94 90 bottom
C11  22.86,52.07 90 top
C12  19.56,46.48 180 top
C13  41.91,48.26 90 bottom
C14  34.29,31.75 270 bottom
C15  40.64,19.05 180 bottom
C16  40.64,46.99 90 top
C17  49.53,46.99 270 top
D2  11.43,52.07 0 top
D3  45.09,29.97 180 top
D4  12.7,25.4 270 top
D5  44.44,32.74 0 top
DRIVER  57.15,50.8 270 top
GND  47.02,18.31 0 top
J2  15.24,58.42 180 top
L1  11.43,13.97 0 top
L2  45.72,52.07 180 bottom
LOAD  25.4,49.53 0 top
OC  19.05,38.1 0 top
OD  13.97,45.72 0 top
PIC  50.8,2.54 180 top
PRTGND  7.62,55.88 0 top
PWM  19.05,13.97 0 top
Q3  29.21,45.72 270 bottom
Q4  34.29,40.64 0 bottom
R1  14.22,42.16 180 top
R2  8.37,32.98 270 top
R3  26.67,52.07 180 top
R4  32.92,3.86 270 top
R12  3.81,25.4 180 top
R14  8.89,52.07 90 top
R15  17.78,49.53 270 top
R16  26.42,42.16 270 top
R17  3.81,19.05 180 top
R18  36.83,35.56 0 bottom
R19  31.75,35.56 0 bottom
R20  29.21,40.64 180 bottom
R21  36.83,31.75 90 bottom
R22  25.4,45.72 270 bottom
R24  52.59,32.37 90 top
R25  39.88,8.89 90 bottom
R26  53.34,43.18 270 bottom
R27  50.8,24.13 270 bottom
R28  31.75,31.75 270 bottom
R30  32.5,42.05 90 top
S1  2.41,48.39 270 top
S3  46.23,10.16 0 top
TEMP  57.15,40.64 90 top
TSTSPPLY  57.15,26.67 270 top
U1  10.16,43.18 0 top
U2  3.81,12.7 270 top
U3  45.72,48.26 0 bottom
U8  30,16.19 0 top
U9  2.54,33.02 90 top
U10  57.15,33.02 270 top
U11  27.94,3.81 180 top
U12  27.94,57.15 0 top
U$1  15.24,17.78 90 top
U$3  19.05,42.16 90 top
U$4  24.13,38.1 90 top
USB+  22.86,57.15 0 top
Y2  43.18,22.86 0 top

### Tracks (layer width: path | path; a pad name or v marks a point on that pad's centre or on a via)
3.3V  (via drill 0.51)
  Top 0.305: 59.39,10.16 59.39,7.32 58.42,6.35 55.88,6.35 54.61,5.08 54.61,2.54 52.68,0.61 48.92,0.61 48.26,1.27 PIC.2 46.99,3.81 45.72,3.81 40.64,8.89 +3.3V.1 33.02,8.89 31.75,10.16 31.75,14.21 32.63,15.09 33.44,15.09 U8.20 39.57,15.22 v39.88,14.92 | 59.39,10.16 58.63,10.92 BLUETOOTH.2 | TEMP.1 58.12,43.18 59.39,41.91 59.39,26.37 TSTSPPLY.2 59.39,21.59 59.39,10.16
  Bottom 0.305: U3.3 49.43,47.31 | C15.1 39.88,18.96 v39.88,14.92 R25.2 | R26.1 54.61,43.18 TEMP.1 59.39,45.42 59.39,52.07 58.12,53.34 52.07,53.34 50.8,52.07 50.8,48.26 49.95,47.41 C7.1
  Bottom 0.61: 49.43,47.31 C7.1
12V  (via drill 0.51)
  Top 0.305: +12V.1 16.94,35.66 26.27,35.66 28.91,33.02 29.21,33.02
  Top 0.61: C16.+ 40.64,35.56 36.83,31.75 30.48,31.75 26.7,27.96 v22.23,27.96 | v16.51,27.94 13.04,27.94 | 13.04,27.94 D4.C | C16.+ 32.15,40.24 v29.21,43.18 | C16.+ 40.24,40.24 38.1,38.1 38.1,35.56 35.56,33.02 29.21,33.02 26.67,30.48 16.59,30.48 12.75,34.31 10.73,34.31 10.46,34.04 10.46,30.78 9.49,29.81 2.63,29.81 1.79,28.97 1.79,27.61 2.69,26.71 5.04,26.71 7.62,24.13 7.62,6.65 U$1.VOUT+ | C1.1 6.35,18.15 6.35,22.86 v3.81,25.4 | R12.1 13.04,27.94
  Bottom 0.61: v22.23,27.96 16.54,27.96 v16.51,27.94 | R20.1 26.67,42.33 26.67,44.75 27.64,45.72 Q3.S1 | Q3.S1 28.66,45.72 28.68,45.71 29.21,46.24 29.21,46.99 30.48,48.26 31.75,48.26 36.83,43.18 36.83,41.91 38.5,40.24 C16.+ | Q3.S1 28.74,45.72 29.23,45.23 29.23,43.2 v29.21,43.18 | v3.81,25.4 R12.1
ADC  (via drill 0.51)
  Top 0.305: U8.2 25.12,19.77 24.66,20.23 24.66,21.14 24.65,21.16 25.46,21.97 27.94,21.97 | 27.94,21.97 29.49,21.97 31.64,24.12 33.01,24.12 36.37,27.48 49.72,27.48 51.26,29.02 51.26,34.12 56.71,39.57 57.59,39.57 58.22,40.2 58.22,41.08 57.59,41.71 56.3,41.71 50.34,35.75 50.34,29.4 49.34,28.4 34.29,28.4 33.83,28.4 32.56,28.4 31.75,29.21 v31.75,29.32 | ADC.1 27.94,23.32 27.94,21.97
  Bottom 0.305: v31.75,29.32 R28.2
BATT+  (via drill 0.35)
  Top 0.61: C11.1 18.62,51.22 R15.1 16.51,49.11 v16.51,48.26 | U1.3 11.11,39.05 BATT+.1 9.78,37.72 BATT.1 1.65,37.72 0.76,38.61 0.76,49.34 1.55,50.13 3.06,50.13 3.82,50.89 S1.1
  Bottom 0.61: BATT+.1 13.97,41.91 15.24,41.91 16.51,43.18 v16.51,48.26
BLUE_LEDS_1  (via drill 0.51)
  Top 0.305: U9.6 U9.5 U9.4 4.53,35.2 22.86,35.2 23.22,35.2 25.76,35.2 v26.67,34.29 | v35.56,10.04 34.34,10.05 33.55,11.27 U8.15
  Bottom 0.305: v35.56,10.04 35.56,26.67 34.29,27.94 30.48,27.94 26.67,31.75 v26.67,34.29
BLUE_LEDS_2  (via drill 0.51)
  Top 0.305: U8.3 v27.94,19.05 | v33.02,22.86 36.83,26.67 54.61,26.67 55.88,27.94 57.15,30.48 U10.5 | U10.4 U10.5 | U10.5 U10.6
  Bottom 0.305: v33.02,22.86 31.75,22.86 v27.94,19.05
BLUETOOTH_ON/OFF
  Top 0.305: BLUETOOTH.5 53.49,15.65 40.64,15.65 40.43,15.86 U8.21
  Bottom 0.305: BLUETOOTH.5 54.15,19.93 R27.2
DRIVER  (via drill 0.35)
  Top 0.61: D5.A 48.88,36.18 53.34,40.64 53.34,46.99 DRIVER.1 53.34,50.8 52.07,49.53 52.07,46.99 50.8,45.72 39.37,45.72 34.29,50.8 v30.48,50.8
  Bottom 0.61: D5.A 48.88,29.98 D3.C | DRIVER.1 53.34,50.8 52.07,49.53 52.07,46.99 50.8,45.72 39.37,45.72 35.56,49.53 30.48,49.53 28.01,47.06 Q3.D1 | Q3.D1 25.5,46.67 R22.1 | Q3.D1 28.01,48.33 v30.48,50.8
GND  (via drill 0.35, 0.51)
  other vias: 54.1,29.21 28.45,17.53 37.57,14.57 3.81,15.24
  pour Top (isolate 0.305): 24.64,39.12 24.64,59.94 59.94,59.94 59.94,0 0,0 0,35.31 0.25,35.56 24.64,35.56
  pour Bottom (isolate 0.305): 24.64,39.12 24.64,59.94 59.94,59.94 59.94,0 0,0 0,35.56 24.64,35.56
GND1  (via drill 0.35)
  Top 0.61: C9.2 13.97,49.95 13.97,52.07 16.51,52.07 17.78,53.34 22.44,53.34 C11.2
  other vias: 9.72,45.85
  pour Top (isolate 0.305): 0,59.94 23.62,59.94 23.62,36.07 0,36.07
  pour Bottom (isolate 0.305): 0,59.94 23.62,59.94 23.62,36.07 0,36.07
LOAD  (via drill 0.51)
  Top 0.61: v7.62,48.26 7.49,48.39 S1.2
  Bottom 0.305: C13.1 42.01,47.31 U3.4 U3.5
  Bottom 0.61: 24.13,54.61 27.94,58.42 28.06,58.3 R30.2 34.41,58.3 38.1,54.61 38.1,49.53 40.32,47.31 42.01,47.31 | 24.13,54.61 19.05,54.61 12.7,48.26 v7.62,48.26 | 24.13,54.61 24.13,50.8 LOAD.1
MCLR  (via drill 0.51)
  Top 0.305: v29.21,19.05 27.85,20.41 U8.1 | v41.91,8.89 42.64,8.89 S3.3 45.34,6.35 48.26,6.35 49.53,5.08 49.53,3.81 PIC.1
  Bottom 0.305: v29.21,19.05 31.75,16.51 31.75,10.16 33.02,8.89 35.56,8.89 36.83,7.62 39.46,7.62 R25.1 41.06,8.04 v41.91,8.89
N$1
  Top 0.61: R14.2 10.58,52.92 10.68,52.82 D2.C
N$2  (via drill 0.51)
  Top 0.61: C3.1 2.96,11.35 U2.4 U2.5 4,11.64 4,12.24 4.27,12.51 6.16,12.51 v6.35,12.7 | v10.16,12.7 11.43,13.97 11.43,17.78 | 11.43,17.78 L1.1 | R30.1 32.1,25.4 27.94,25.4 25.4,22.86 21.59,22.86 20.32,24.13 | U$1.VIN+ 15.56,29.21 19.05,29.21 20.32,27.94 20.32,24.13 | 20.32,24.13 19.05,22.86 16.51,22.86 11.43,17.78
  Bottom 0.61: v6.35,12.7 v10.16,12.7
N$3
  Top 0.305: U9.1 U9.2 U9.3 4.2,32.13 R2.2
N$4
  Bottom 0.61: D5.C 36.97,32.74 R21.2 C14.1 R28.1
N$5
  Top 0.305: U12.1 U12.2 U12.3 26.39,52.21 R3.2
N$7
  Top 0.61: R14.1 8.89,46.99 7.62,45.72 7.62,43.18 8.92,41.88 U1.1
N$9
  Top 0.61: R1.2 12.29,43.24 10.19,43.24 9.21,44.22 U1.5
N$10
  Top 0.61: U$3.2 19.05,41.66 19.56,42.16 25.57,42.16 R16.2
N$11  (via drill 0.35)
  Top 0.305: USB+.1 22.86,55.88 21.59,54.61 16.57,54.61 16.54,54.64 | J2.1 16.54,54.64 | 16.54,54.64 v15.24,53.34
  Top 0.61: v12.7,52.07 12.18,52.07 D2.A C9.1 10.47,48.15 10.47,46.67 11.11,46.03 U1.4
  Bottom 0.61: v12.7,52.07 13.97,53.34 v15.24,53.34
N$12  (via drill 0.51)
  Top 0.61: U2.1 v6.35,15.24 | v12.7,12.45 11.43,10.54 L1.2 | D4.A 10.75,23.2 v9.91,22.35
  Bottom 0.61: v6.35,15.24 8.89,15.24 | 8.89,15.24 11.43,15.24 12.7,13.97 v12.7,12.45 | v9.91,22.35 9.91,20.07 8.89,19.05 8.89,15.24
N$13
  Top 0.61: U2.3 1.27,15.24 1.27,17.78 | 1.27,17.78 R17.2 | R12.2 1.27,17.78
N$14
  Bottom 0.61: L2.1 44.58,51.8 U3.6
N$15
  Bottom 0.305: L2.2 46.86,51.8 U3.1
N$17
  Top 0.61: U$4.6 21.55,39.19 21.48,39.12 20.71,39.88 18.54,39.88 18.1,40.32 U$3.1 18.1,41.59 OD.1
N$18
  Top 0.61: U$3.3 21.17,41.06 21.59,40.64 24.38,40.64 25.08,39.94 U$4.4 25.08,38.8 24.38,38.1 OC.1
N$19
  Top 0.61: C16.- 40.69,53.74 C17.+
N$20
  Top 0.61: U$3.5 19.05,43.69 20.41,45.05 C12.1 20.57,46.65 20.57,47.75 19.65,48.68 R15.2
N$21
  Top 0.305: U10.1 U10.2 U10.3 54.51,34.57 R24.2
N$22
  Bottom 0.61: Q4.1 35.24,36.3 R18.2 R19.1
N$23
  Bottom 0.61: Q3.G1 30.8,46.67 31.75,45.72 31.75,42.33 32.34,41.74 | 32.34,41.74 Q4.3 | R20.2 31.24,40.64 32.34,41.74
N$25
  Top 0.305: R4.2 32.85,2.81 U11.1 U11.2 U11.3
OSC1
  Top 0.305: U8.9 27.93,15.22 30.02,17.32 30.02,20.51 31.56,22.05 34.48,22.05 37.48,19.05 39.37,19.05 40.64,20.32 40.64,22.76 Y2.1
  Bottom 0.305: C8.1 43.18,25.3 Y2.1
OSC2
  Top 0.305: U8.10 28.53,14.56 30.48,16.51 30.48,20.32 31.75,21.59 34.29,21.59 37.38,18.5 43.9,18.5 45.62,20.22 Y2.2
  Bottom 0.305: C10.1 45.72,22.96 Y2.2
PGC
  Top 0.305: U8.27 33.44,19.63 32.63,19.63 31.75,18.75 31.81,16.45 31.81,15.75 31.1,14.97 31.09,9.42 31.75,8.89 33.02,7.62 35.56,7.62 36.83,6.35 36.83,5.08 38.1,3.81 39.37,3.81 PIC.5
PGD
  Top 0.305: PIC.4 42.4,2.54 40.47,0.61 36.83,0.61 35.56,1.88 35.56,5.08 34.29,6.35 33.02,6.35 30.48,8.89 30.48,15.24 31.1,15.86 31.1,19.7 31.69,20.29 33.47,20.29 U8.28
PWM  (via drill 0.51)
  Top 0.305: v26.67,8.89 27.94,10.16 27.94,11.93 27.37,12.49 26.53,12.49 U8.13
  Bottom 0.305: v26.67,8.89 22.86,8.89 21.59,10.16 21.59,13.97 | PWM.1 21.59,13.97 | 21.59,13.97 21.59,23.37 25.4,27.18 R22.2
RED_LEDS_1  (via drill 0.51)
  Top 0.305: U12.6 U12.5 U12.4 29.21,55.87 29.21,49.53 27.94,48.26 v27.94,36.83 | v36.83,12.58 U8.16
  Bottom 0.305: v36.83,12.58 36.83,27.94 36.13,28.64 31.05,28.64 27.94,31.75 v27.94,36.83
RED_LEDS_2
  Top 0.305: U11.6 U11.5 U11.4 24.4,4.81 22.86,6.35 22.86,17.78 23.84,18.48 U8.4
RX
  Top 0.305: U8.18 40.69,13.9 41.98,15.19 54.56,15.19 55.37,16 BLUETOOTH.4
SOLENOID_ON/OFF  (via drill 0.35)
  Top 0.305: U8.26 33.7,19 34.53,19 37.02,16.51 v49.53,16.51
  Bottom 0.305: R18.1 40.22,38.1 45.72,38.1 46.99,36.83 46.99,27.93 49.28,26.32 49.53,26.07 49.53,20.32 50.8,19.05 50.8,17.78 v49.53,16.51
TEMP_DQ  (via drill 0.51)
  Top 0.305: U8.14 24.59,11.98 v24.12,12.66 | TEMP.2 55.88,40.64 50.8,35.56 50.8,29.21 49.53,27.94 28.19,27.94 v25.15,24.89
  Bottom 0.305: v24.12,12.66 24.13,22.86 25.15,23.88 v25.15,24.89 | TEMP.2 53.91,40.64 R26.2
TX
  Top 0.305: BLUETOOTH.3 55.12,14.73 42.42,14.73 40.95,13.27 U8.17

### Text on the board
tPlace: USB | C16 | C17 | - | + | +12V | GND | 3.3V | U3 | - | - | DQ | + | + | U4 | GND | VIN+ | VIN- | R30 | - | + | ON/OFF | RX | TX | U2 | 3.3V | L1 | GND | VOUT / +12V | VOUT / GND | PGC | PGD | GND | 3.3V | MCLR | PICKIT
bPlace: smartBobber 2019 | “There’s a fine line / between fishing / and standing on / the shore like an / idiot.” / - Steven Wright | Designed By: / Zachary L. Hutson / Ryan D. Pascal / Zachary L. Pyle / Nicholas C. Spoutz / / Special Thanks To: / Dr. Michael L. French / Gregory A. Lewis
bNames: U3